# Altium schematic sheet Control.SchDoc
size A4; SheetNumber: 4; SheetTotal: 4
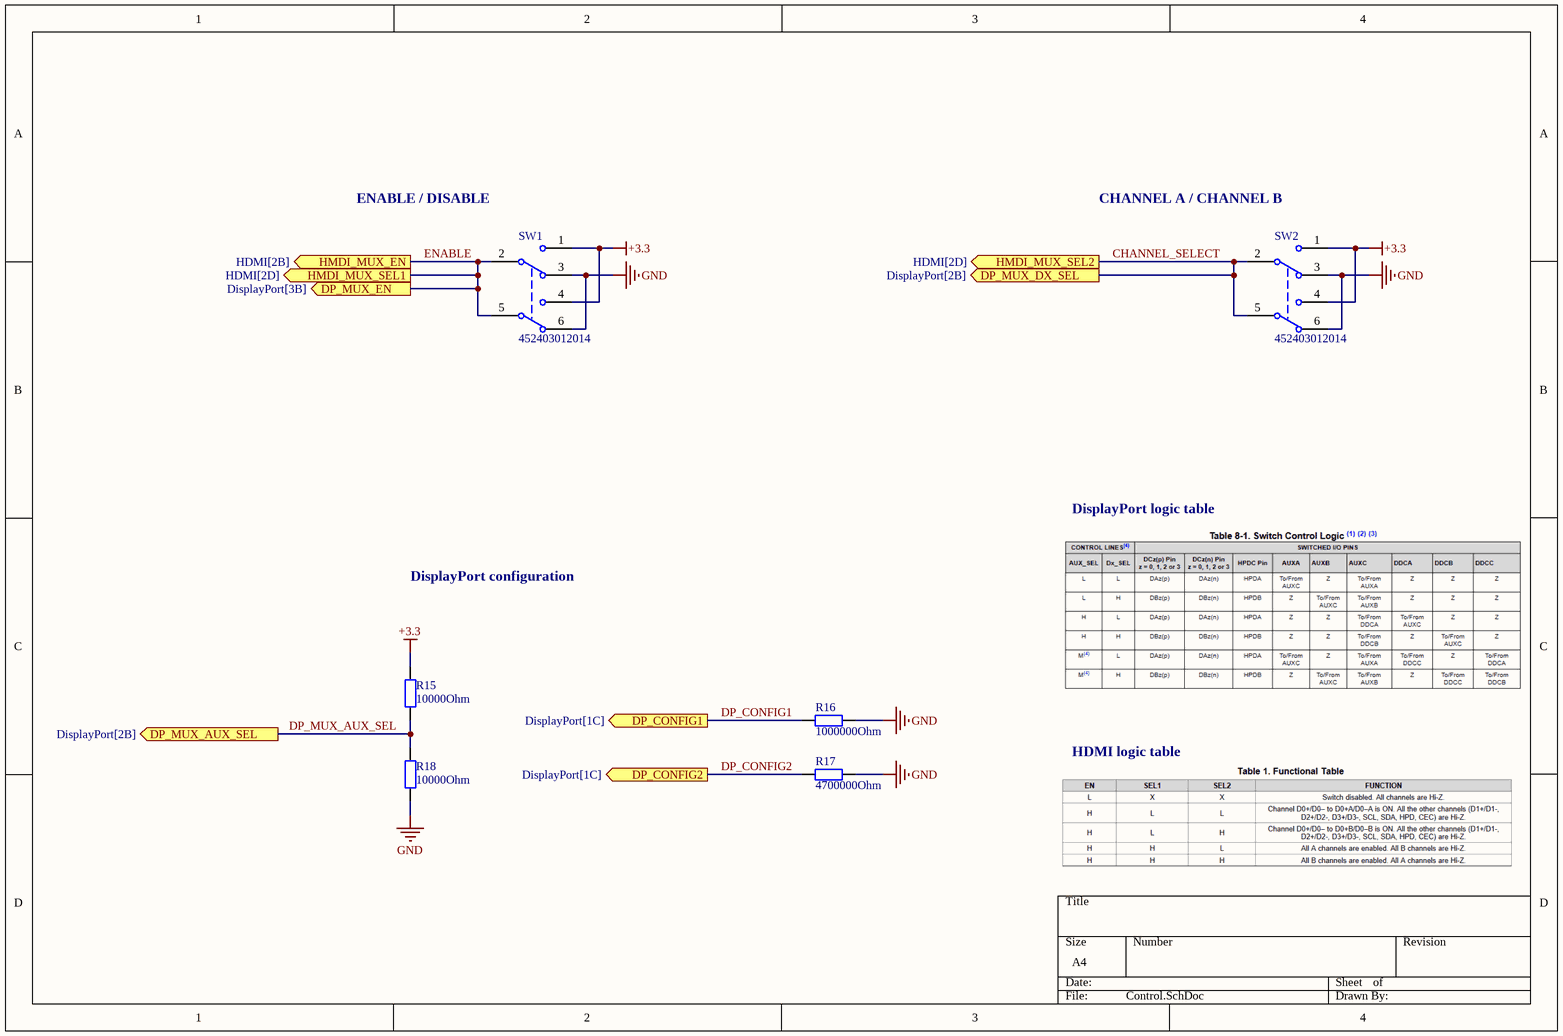
[diagram p0: Control.SchDoc]

## Parts
R15  Resistance: 10000Ohm  [WRIS-RSKS_0402]  (hidden comment: 10000Ohm, 100mW)
R16  Resistance: 1000000Ohm  [WRIS-RSKS_0402]  (hidden comment: 1000000Ohm, 100mW)
R17  Resistance: 4700000Ohm  [WRIS-RSKS_1206_Reflow]  (hidden comment: 4700000Ohm, 250mW)
R18  Resistance: 10000Ohm  [WRIS-RSKS_0402]  (hidden comment: 10000Ohm, 100mW)
SW1  452403012014  [452403012014]
SW2  452403012014  [452403012014]

## Ports
DP_CONFIG1 (out, see DisplayPort[1C]), DP_CONFIG2 (out, see DisplayPort[1C]), DP_MUX_AUX_SEL (out, see DisplayPort[2B]), DP_MUX_DX_SEL (out, see DisplayPort[2B]), DP_MUX_EN (out, see DisplayPort[3B]), HMDI_MUX_EN (out, see HDMI[2B]), HMDI_MUX_SEL1 (out, see HDMI[2D]), HMDI_MUX_SEL2 (out, see HDMI[2D])

## Nets
+3.3: R15.2 SW1.1 SW1.4 SW2.1 SW2.4
GND: R16.1 R17.1 R18.1 SW1.3 SW1.6 SW2.3 SW2.6
CHANNEL_SELECT: SW2.2(COM) SW2.5(COM) ; port DP_MUX_DX_SEL, port HMDI_MUX_SEL2
DP_CONFIG1: R16.2 ; port DP_CONFIG1
DP_CONFIG2: R17.2 ; port DP_CONFIG2
DP_MUX_AUX_SEL: R15.1 R18.2 ; port DP_MUX_AUX_SEL
ENABLE: SW1.2(COM) SW1.5(COM) ; port HMDI_MUX_EN, port HMDI_MUX_SEL1, port DP_MUX_EN

## Notes on the sheet
- ENABLE / DISABLE
- (near SW2) CHANNEL A / CHANNEL B
- DisplayPort logic table
- DisplayPort configuration
- HDMI logic table

## Library data of the parts
R15 R18 = 560112110020: WRIS-RSKS Thick Film Resistor, size 0402, 10000Ohm, 100mW; Manufacturer: Wurth Elektronik; Case/Size Code: 0402; Limiting Element Voltage: 50V; Resistance Tolerance: +/-1%; Temperature Coefficient of Resistance Min: -100ppm/°C; Temperature Coefficient of Resistance Max: 100ppm/°C; Manufacturer Part Number: 560112110020; Category: Thick Film Resistors; Match Code: WRIS-RSKS; ComponentLink1Description: Website Link; ComponentLink1URL: https://www.we-online.com/redexpert/article/560112110020?ad; ComponentLink2Description: Datasheet Link; ComponentLink2URL: https://www.we-online.com/redexpert/spec/560112110020?ad; Mount: Surface Mount; Operating Temperature Max: 155°C; Operating Temperature Min: -55°C; Packaging: Tape and Reel; Length: 1mm; Width: 0.5mm; Height: 0.35mm; Rated Power: 100mW
R16 = 560112110033: WRIS-RSKS Thick Film Resistor, size 0402, 1000000Ohm, 100mW; Manufacturer: Wurth Elektronik; Case/Size Code: 0402; Limiting Element Voltage: 50V; Resistance Tolerance: +/-1%; Temperature Coefficient of Resistance Min: -100ppm/°C; Temperature Coefficient of Resistance Max: 100ppm/°C; Manufacturer Part Number: 560112110033; Category: Thick Film Resistors; Match Code: WRIS-RSKS; ComponentLink1Description: Website Link; ComponentLink1URL: https://www.we-online.com/redexpert/article/560112110033?ad; ComponentLink2Description: Datasheet Link; ComponentLink2URL: https://www.we-online.com/redexpert/spec/560112110033?ad; Mount: Surface Mount; Operating Temperature Max: 155°C; Operating Temperature Min: -55°C; Packaging: Tape and Reel; Length: 1mm; Width: 0.5mm; Height: 0.35mm; Rated Power: 100mW
R17 = 560112132029: WRIS-RSKS Thick Film Resistor, size 1206, 4700000Ohm, 250mW; Manufacturer: Wurth Elektronik; Case/Size Code: 1206; Limiting Element Voltage: 200V; Resistance Tolerance: +/-1%; Temperature Coefficient of Resistance Min: -200ppm/°C; Temperature Coefficient of Resistance Max: 200ppm/°C; Manufacturer Part Number: 560112132029; Category: Thick Film Resistors; Match Code: WRIS-RSKS; ComponentLink1Description: Website Link; ComponentLink1URL: https://www.we-online.com/redexpert/article/560112132029?ad; ComponentLink2Description: Datasheet Link; ComponentLink2URL: https://www.we-online.com/redexpert/spec/560112132029?ad; Mount: Surface Mount; Operating Temperature Max: 155°C; Operating Temperature Min: -55°C; Packaging: Tape and Reel; Length: 3.1mm; Width: 1.6mm; Height: 0.6mm; Rated Power: 250mW
SW1 SW2 = CMP-03913-71472420-1: 452403012014 Slide Switch, Dpdt, 0.3A, 6Vdc, Smd Rohs Compliant: Yes; Voltage Rating: 6V; Switch Function: On-On; Actuator Length: 1.2mm; Switch Travel: 2mm; Current Rating: 300mA; Insulation Resistance: 100MΩ; Actuator Material: Liquid Crystal Polymer, Polymer; Contact Style: Non-Shorting; Termination: SMD/SMT; Mount: Surface Mount; Min Operating Temperature: -40°C; Contact Plating: Silver; RoHS: Compliant; Color: Silver; Throw Configuration: DPDT; Voltage Rating (DC): 6V; Max Operating Temperature: 85°C; NexarPartId: 71472420; Packaging: Tape and Reel